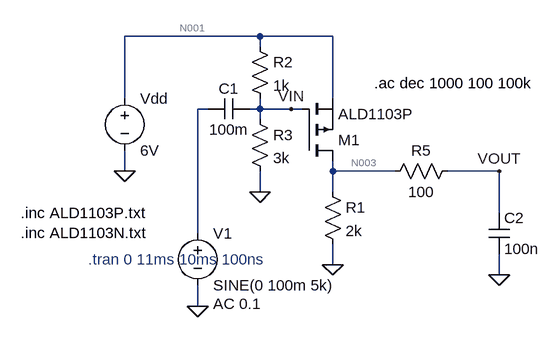
[diagram p0: schematic cs_amp.asc]
cs_amp.asc, the LTspice schematic file:
Version 4.1
SHEET 1 880 680
WIRE 80 -32 -128 -32
WIRE 192 -32 80 -32
WIRE 80 -16 80 -32
WIRE -128 64 -128 -32
WIRE 192 64 192 -32
WIRE 0 80 -16 80
WIRE 80 80 80 64
WIRE 80 80 64 80
WIRE 128 80 80 80
WIRE 144 80 128 80
WIRE 80 96 80 80
WIRE -128 176 -128 144
WIRE 192 176 192 160
WIRE 288 176 192 176
WIRE 448 176 368 176
WIRE 80 208 80 176
WIRE 192 208 192 176
WIRE 448 240 448 176
WIRE -16 272 -16 80
WIRE 192 320 192 288
WIRE 448 336 448 304
WIRE -16 384 -16 352
FLAG -128 176 0
FLAG 192 320 0
FLAG 80 208 0
FLAG 128 80 VIN
FLAG -16 384 0
FLAG 448 336 0
FLAG 448 176 VOUT
SYMBOL pmos 144 160 M180
SYMATTR InstName M1
SYMATTR Value ALD1103P
SYMBOL voltage -128 48 R0
WINDOW 123 0 0 Left 0
WINDOW 39 0 0 Left 0
SYMATTR InstName Vdd
SYMATTR Value 6V
SYMBOL res 176 192 R0
SYMATTR InstName R1
SYMATTR Value 2k
SYMBOL res 64 -32 R0
SYMATTR InstName R2
SYMATTR Value 1k
SYMBOL res 64 80 R0
SYMATTR InstName R3
SYMATTR Value 3k
SYMBOL voltage -16 256 R0
WINDOW 123 24 124 Left 2
WINDOW 39 0 0 Left 0
SYMATTR Value2 AC 0.1
SYMATTR InstName V1
SYMATTR Value SINE(0 100m 5k)
SYMBOL cap 64 64 R90
WINDOW 0 0 32 VBottom 2
WINDOW 3 32 32 VTop 2
SYMATTR InstName C1
SYMATTR Value 100m
SYMBOL res 384 160 R90
WINDOW 0 0 56 VBottom 2
WINDOW 3 32 56 VTop 2
SYMATTR InstName R5
SYMATTR Value 100
SYMBOL cap 432 240 R0
SYMATTR InstName C2
SYMATTR Value 100n
TEXT -288 240 Left 2 !.inc ALD1103P.txt\n.inc ALD1103N.txt
TEXT -184 312 Left 2 ;.tran 0 11ms 10ms 100ns
TEXT 256 40 Left 2 !.ac dec 1000 100 100k

The netlist it stands for:
* cs_amp.asc
M1 N003 VIN N001 N001 ALD1103P
Vdd N001 0 6V
R1 N003 0 2k
R2 N001 VIN 1k
R3 VIN 0 3k
V1 N002 0 SINE(0 100m 5k) AC 0.1
C1 VIN N002 100m
R5 VOUT N003 100
C2 VOUT 0 100n
.model NMOS NMOS
.model PMOS PMOS
.lib standard.mos
.inc ALD1103P.txt
.inc ALD1103N.txt
* .tran 0 11ms 10ms 100ns
.ac dec 1000 100 100k
.backanno
.end

* Results of the author's LTspice run, read from the files saved beside the schematic
* Operating Point, zero values left out:
*   V(vin) = 4.5 V
*   V(vout) = 2.357 V
*   V(n003) = 2.357 V
*   V(n001) = 6 V
*   Id(M1) = -1.179 mA
*   Is(M1) = 1.179 mA
*   Ib(M1) = 3.653 pA
*   I(R3) = 1.5 mA
*   I(R1) = 1.179 mA
*   I(Vdd) = -2.679 mA
*   I(R2) = 1.5 mA
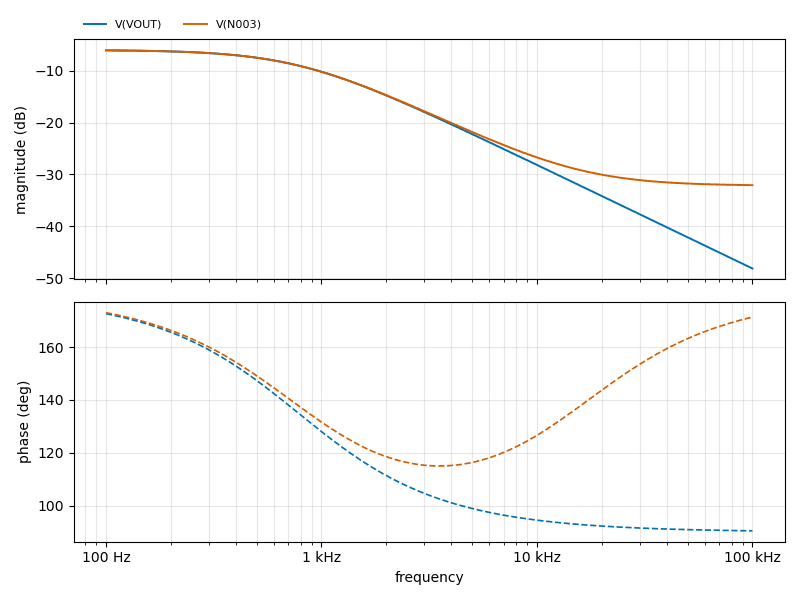
[diagram p1: AC Analysis of cs_amp.asc, plotted from the saved traces]
* AC Analysis, 1 run:
*   V(VOUT): -6.08 dB at 100 Hz, -48.14 dB at 100 kHz, peak -6.08 dB at 100 Hz, 3 dB below the peak at 794.8 Hz
*   V(N003): -6.08 dB at 100 Hz, -32.07 dB at 100 kHz, peak -6.08 dB at 100 Hz, 3 dB below the peak at 796.7 Hz